# Altium schematic sheet Schematic_12-5-3v3.SchDoc
size A4
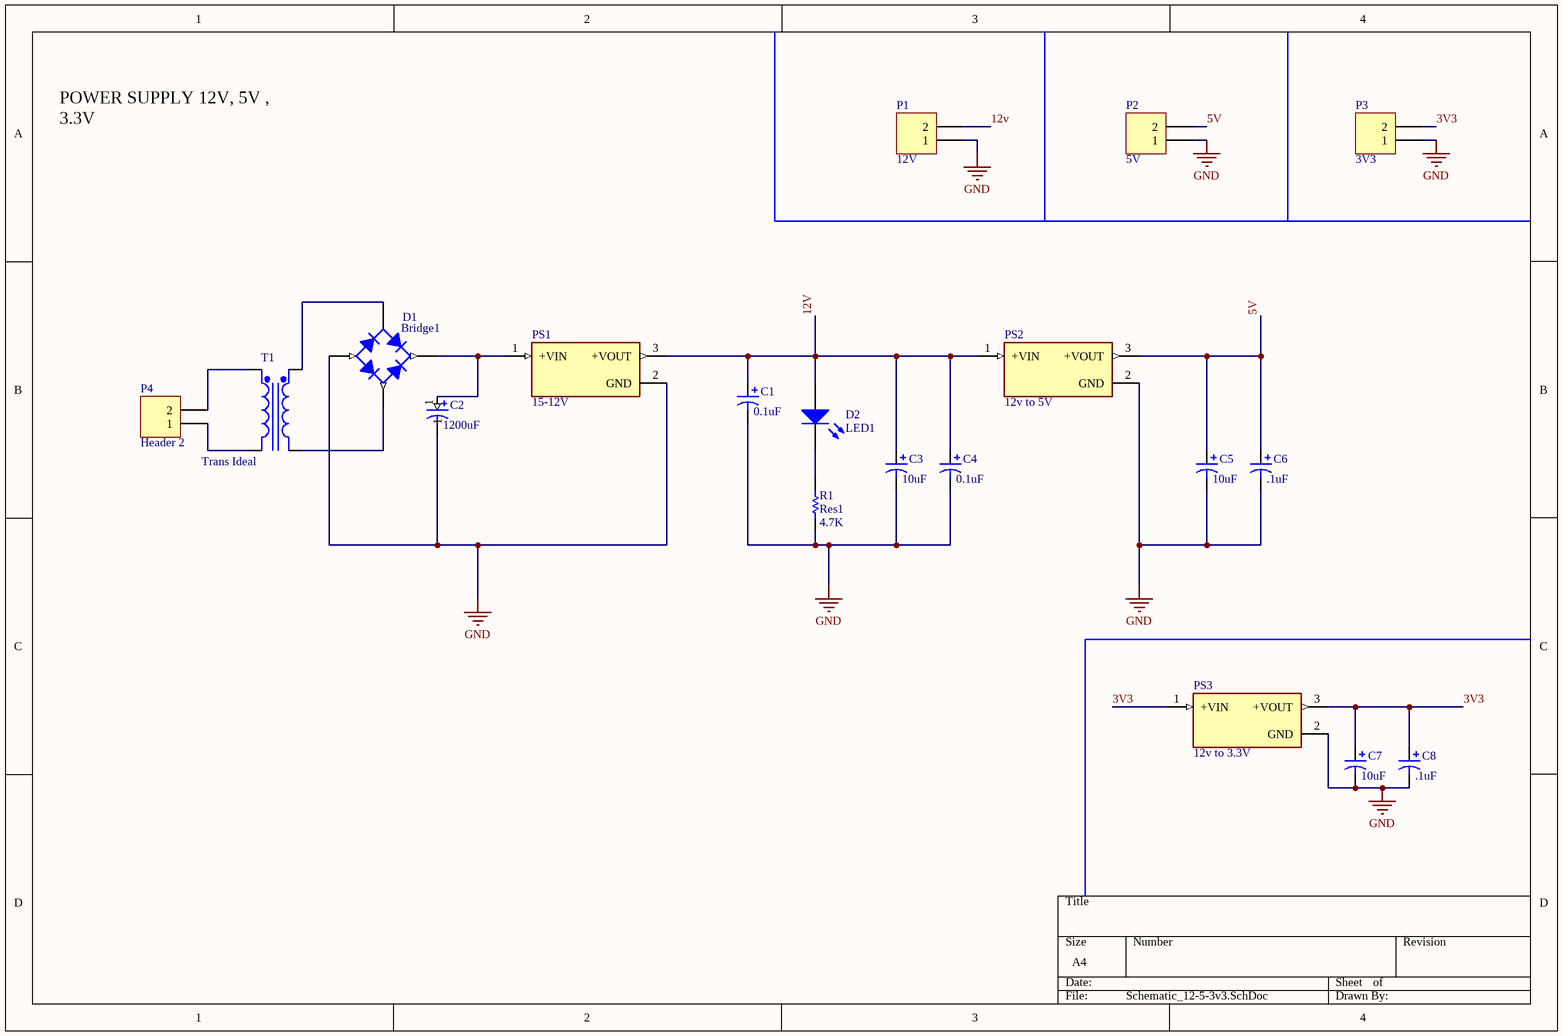
[diagram p0: Schematic_12-5-3v3.SchDoc]

## Parts
C1  value 0.1uF  [1812]  (hidden comment: Cap Pol3)
C2  value 1200uF  [1812]  (hidden comment: Cap Pol3)
C3  value 10uF  [1812]  (hidden comment: Cap Pol3)
C4  value 0.1uF  [1812]  (hidden comment: Cap Pol3)
C5  value 10uF  [1812]  (hidden comment: Cap Pol3)
C6  value .1uF  [1812]  (hidden comment: Cap Pol3)
C7  value 10uF  [1812]  (hidden comment: Cap Pol3)
C8  value .1uF  [1812]  (hidden comment: Cap Pol3)
D1  Bridge1  [D-38]
D2  LED1  [LED-1]
P1  12V  [HDR1X2]
P2  5V  [HDR1X2]
P3  3V3  [HDR1X2]
P4  Header 2  [HDR1X2]
PS1  15-12V  [CONV_R-7812-0.5]
PS2  12v to 5V  [CONV_R-7812-0.5]
PS3  12v to 3.3V  [CONV_R-7812-0.5]
R1  Res1  value 4.7K  [AXIAL-0.3]
T1  Trans Ideal  [TRF_4]

## Nets
GND: C1.2 C2.2 C3.2 C4.2 C5.2 C6.2 C7.2 C8.2 D1.3(A) P1.1 P2.1 P3.1 PS1.2(GND) PS2.2(GND) PS3.2(GND) R1.1
3V3: C7.1 C8.1 P3.2 PS3.1(+VIN) PS3.3(+VOUT)
5V: C5.1 C6.1 P2.2 PS2.3(+VOUT)
12V: C1.1 C3.1 C4.1 D2.1(A) P1.2 PS1.3(+VOUT) PS2.1(+VIN)
NetC2_1: C2.1 D1.1(K) PS1.1(+VIN)
NetD1_2: D1.2(C) T1.4(Sec-)
NetD1_4: D1.4(C) T1.3(Sec+)
NetD2_2: D2.2(K) R1.2
NetP4_1: P4.1 T1.2(Pri-)
NetP4_2: P4.2 T1.1(Pri+)

## Notes on the sheet
- POWER SUPPLY 12V, 5V , 3.3V

## Library data of the parts
C1-C8 = Cap Pol3: Polarized Capacitor (Surface Mount); Published: 8-Jun-2000; LatestRevisionDate: 29-May-2009; LatestRevisionNote: IPC-7351 Footprint Added.; PackageReference: C0805; Publisher: Altium Limited; PackageDescription: Chip Capacitor
D1 = Bridge1: Full Wave Diode Bridge; Published: 8-Jun-2000; LatestRevisionDate: 29-May-2009; LatestRevisionNote: Sch pins A & K swapped.; DatasheetVersion: E2732B; PackageReference: D-38; Publisher: Altium Limited; PackageDescription: Bridge Rectifier; 4 Terminals; Body 9.4 x 9.4 mm (typ); Pitch 5.08 mm
D2 = LED1: Typical RED GaAs LED; Published: 8-Jun-2000; LatestRevisionDate: 08-Jul-2005; LatestRevisionNote: Mech Layer 1 removed.; PackageReference: LED-1; Publisher: Altium Limited; PackageDescription: LED; 2 Leads
P1-P4 = Header 2: Header, 2-Pin; LatestRevisionDate: 17-Jul-2002; LatestRevisionNote: Re-released for DXP Platform.; Publisher: Altium Limited
PS1-PS3 = R-7812-0.5: 0.5A DC/DC-Converter 'INNOLINE' SIP3 reg; MF: Recom Power; SnapEDA_Link: https://www.snapeda.com/parts/R-7812-0.5/Recom%20Power/view-part/531916/?ref=snap; Availability: Good; Value: *; Check_prices: https://www.snapeda.com/parts/R-7812-0.5/Recom%20Power/view-part/531916/?ref=eda; Purchase-URL: https://pricing.snapeda.com/search/part/R-7812-0.5/?ref=eda; Package: SIP-3 Recom Power; Price: None; MP: R-7812-0.5
R1 = Res1: Resistor; Published: 8-Jun-2000; LatestRevisionDate: 17-Jul-2002; LatestRevisionNote: Re-released for DXP Platform.; PackageReference: AXIAL-0.3; Publisher: Altium Limited; PackageDescription: Axial Device, Thru-Hole; 2 Leads; 0.3 in Pin Spacing
T1 = Trans Ideal: Transformer (Ideal); Published: 8-Jun-2000; LatestRevisionDate: 17-Jul-2002; LatestRevisionNote: Re-released for DXP Platform.; PackageReference: TRF_4; Publisher: Altium Limited; PackageDescription: Transformer; 4 Leads